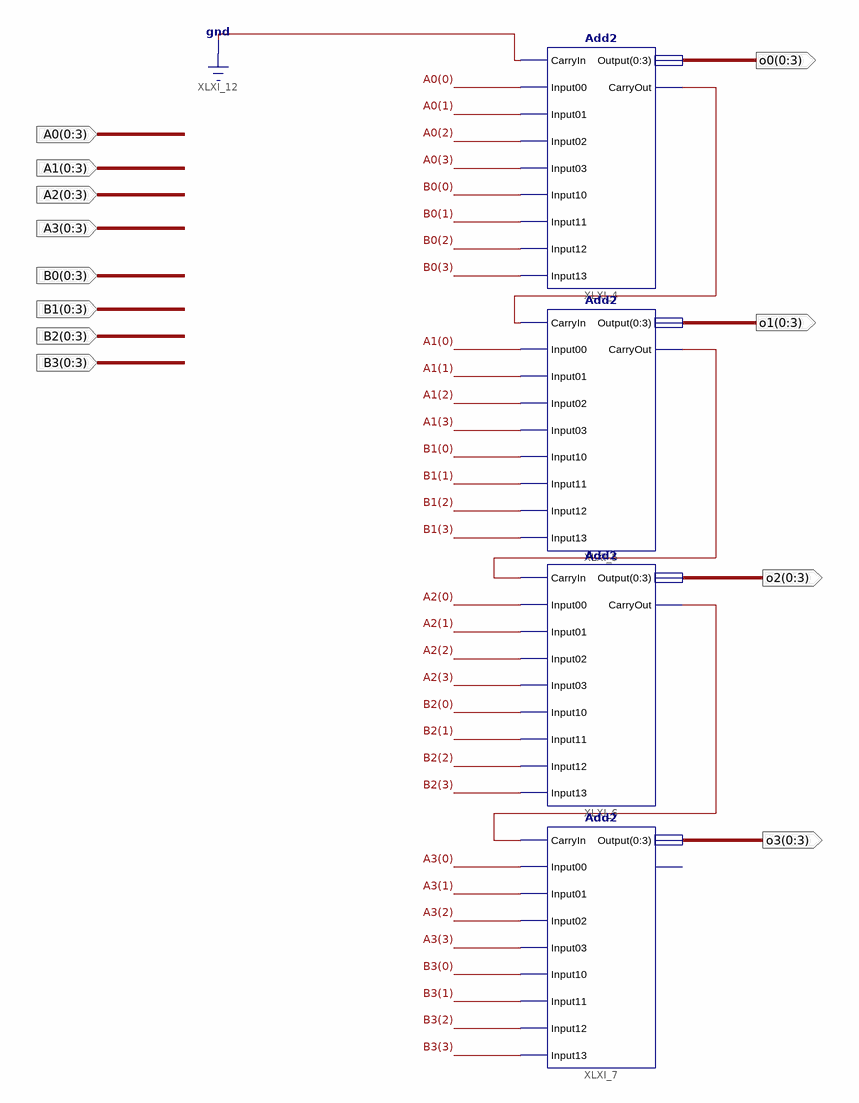
[diagram p0: schematic sheet 1]
// Xilinx ISE schematic Plus.sch (spartan6) as structural Verilog: 4 symbols, 12 ports
module Plus (
  input  [0:3] A0,
  input  [0:3] A1,
  input  [0:3] A2,
  input  [0:3] A3,
  input  [0:3] B0,
  input  [0:3] B1,
  input  [0:3] B2,
  input  [0:3] B3,
  output [0:3] o0,
  output [0:3] o1,
  output [0:3] o2,
  output [0:3] o3
);

  wire XLXN_1, XLXN_2, XLXN_3;

  Add2 XLXI_4 (
    .CarryIn(1'b0), .CarryOut(XLXN_1), .Input00(A0[0]), .Input01(A0[1]), .Input02(A0[2]), .Input03(A0[3]),
    .Input10(B0[0]), .Input11(B0[1]), .Input12(B0[2]), .Input13(B0[3]), .Output(o0));
  Add2 XLXI_5 (
    .CarryIn(XLXN_1), .CarryOut(XLXN_2), .Input00(A1[0]), .Input01(A1[1]), .Input02(A1[2]), .Input03(A1[3]),
    .Input10(B1[0]), .Input11(B1[1]), .Input12(B1[2]), .Input13(B1[3]), .Output(o1));
  Add2 XLXI_6 (
    .CarryIn(XLXN_2), .CarryOut(XLXN_3), .Input00(A2[0]), .Input01(A2[1]), .Input02(A2[2]), .Input03(A2[3]),
    .Input10(B2[0]), .Input11(B2[1]), .Input12(B2[2]), .Input13(B2[3]), .Output(o2));
  Add2 XLXI_7 (
    .CarryIn(XLXN_3), .Input00(A3[0]), .Input01(A3[1]), .Input02(A3[2]), .Input03(A3[3]), .Input10(B3[0]),
    .Input11(B3[1]), .Input12(B3[2]), .Input13(B3[3]), .Output(o3));  // open: CarryOut
endmodule
